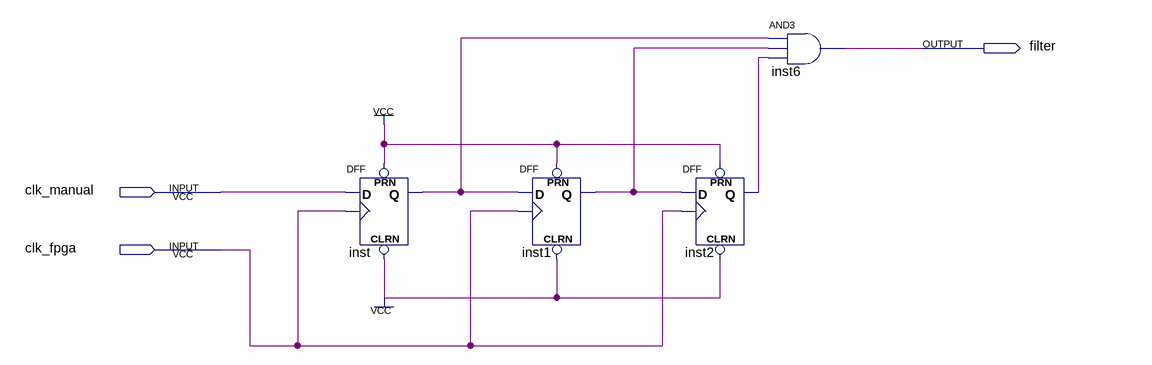
[diagram p0: schematic sheet]
// Quartus schematic digital_filter.bdf as structural Verilog: 4 symbols, 3 pins
module digital_filter (
  input  clk_manual,
  input  clk_fpga,
  output filter
);

  wire inst1_q, inst2_q, inst_q;

  DFF inst (.CLRN(1'b1), .CLK(clk_fpga), .D(clk_manual), .PRN(1'b1), .Q(inst_q));
  DFF inst1 (.CLRN(1'b1), .CLK(clk_fpga), .D(inst_q), .PRN(1'b1), .Q(inst1_q));
  DFF inst2 (.CLRN(1'b1), .CLK(clk_fpga), .D(inst1_q), .PRN(1'b1), .Q(inst2_q));
  and inst6 (filter, inst_q, inst1_q, inst2_q);
endmodule
